# EAGLE design ESP32 Module (EAGLE 9.6.2)
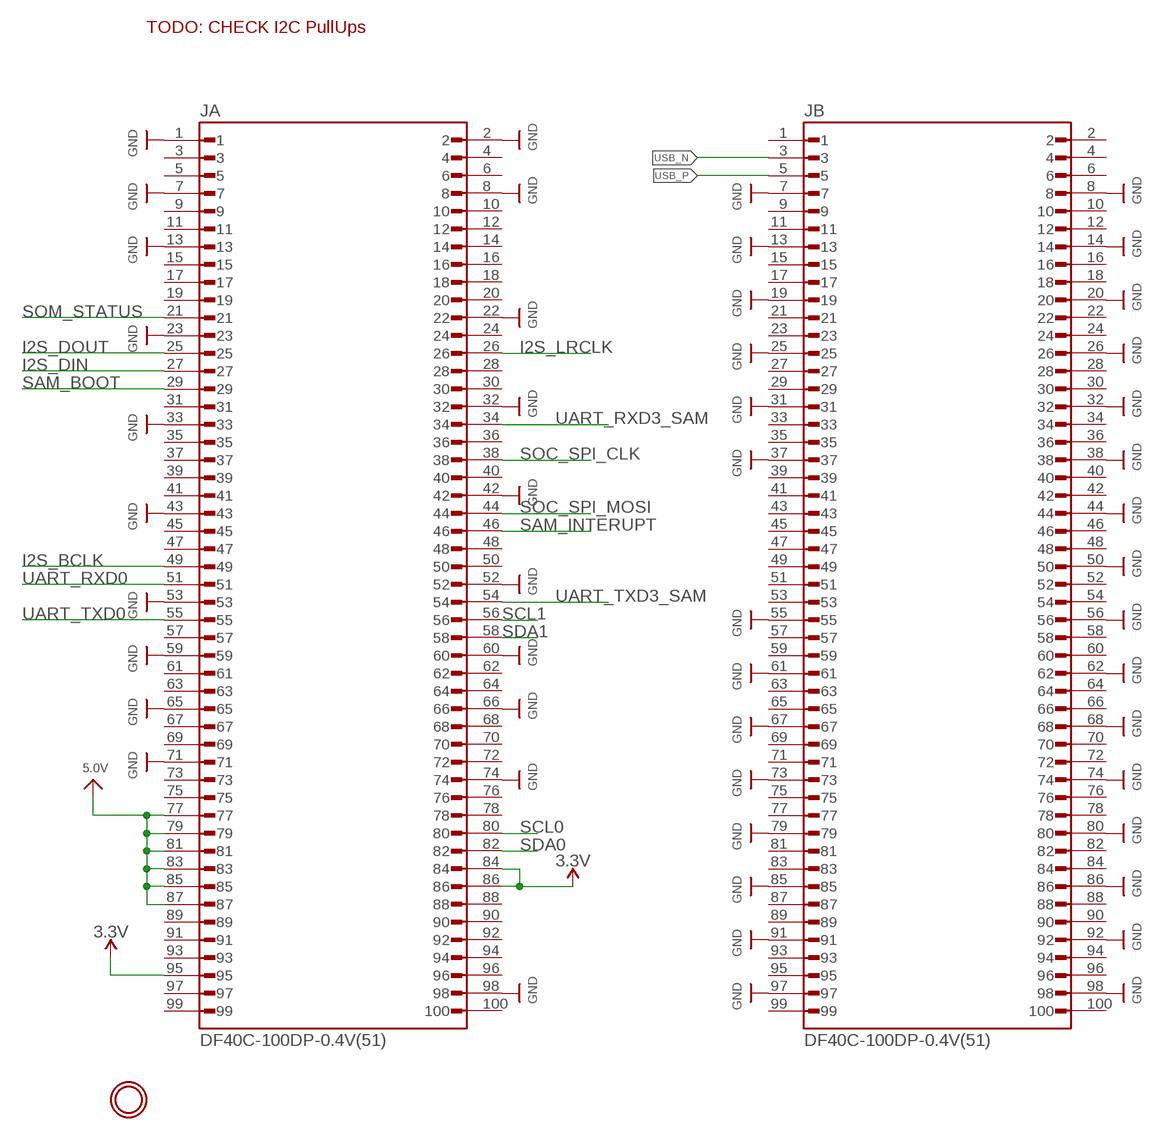
[diagram p0: schematic, sheet 1, part 1 of 3]
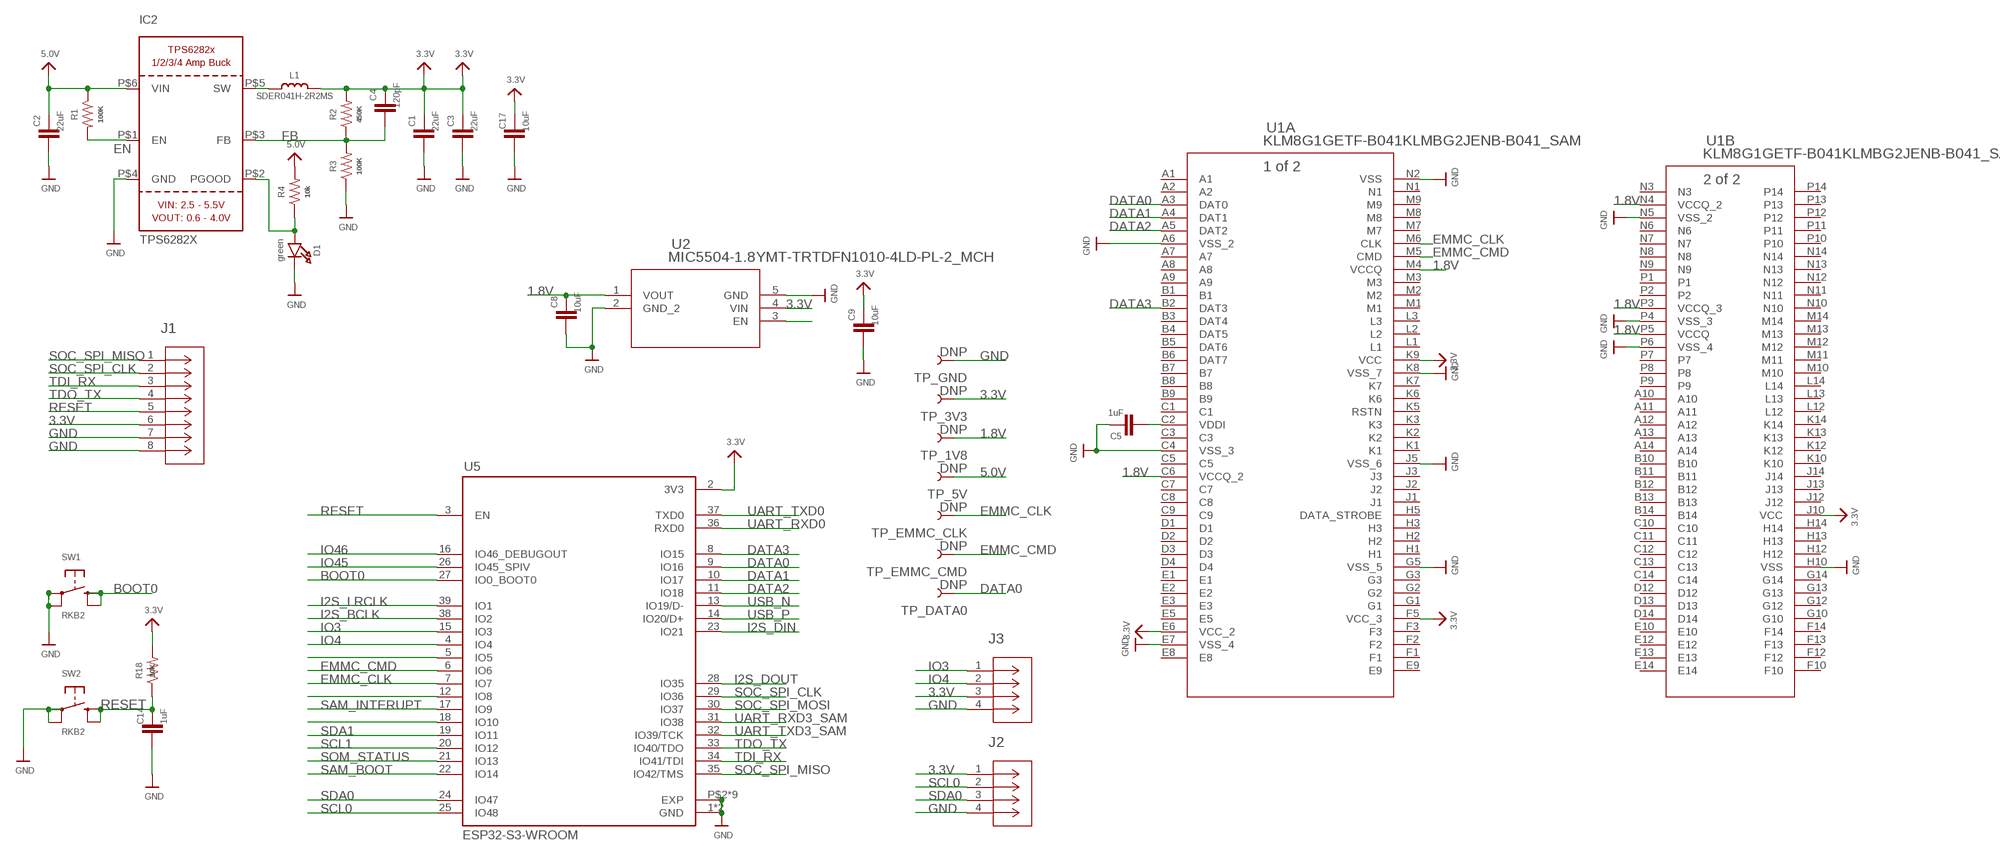
[diagram p1: schematic, sheet 1, part 2 of 3]
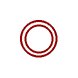
[diagram p2: schematic, sheet 1, part 3 of 3]

## Parts
C1  22uF  C_CHIP-0402(1005-METRIC)  [CAPC1005X60]
C2  22uF  C_CHIP-0603(1608-METRIC)  [CAPC1608X85]
C3  22uF  C_CHIP-0402(1005-METRIC)  [CAPC1005X60]
C4  120pF  C_CHIP-0402(1005-METRIC)  [CAPC1005X60]
C5  1uF  C_CHIP-0402(1005-METRIC)  [CAPC1005X60]
C8  10uF  C_CHIP-0402(1005-METRIC)  [CAPC1005X60]
C9  10uF  C_CHIP-0402(1005-METRIC)  [CAPC1005X60]
C14  1uF  C_CHIP-0402(1005-METRIC)  [CAPC1005X60]
C17  10uF  C_CHIP-0402(1005-METRIC)  [CAPC1005X60]
D1  green  LED0603_NOOUTLINE  [CHIPLED_0603_NOOUTLINE]
IC2  TPS6282X  [VSON_6]
J1  SM08B-SRSS-TB(LF)(SN)CONN_SM08B-SRSS-TB(LF)(SN)_JST  [CONN_SM08B-SRSS-TB(LF)(SN)_JST]
J2  SM04B-SRSS-TBCONN_SM04B-SRSS-TB_JST  [CONN_SM04B-SRSS-TB_JST]
J3  SM04B-SRSS-TBCONN_SM04B-SRSS-TB_JST  [CONN_SM04B-SRSS-TB_JST]
JA  DF40C-100DP-0.4V(51)  [HIROSE_DF40C-100DP-0.4V(51)]
JB  DF40C-100DP-0.4V(51)  [HIROSE_DF40C-100DP-0.4V(51)]
L1  SDER041H-2R2MS  INDUCTOR_SRP0415  [INDUCTOR_4X4MM_SRP0415]
R1  100K  R-US_CHIP-0402(1005-METRIC)  [RESC1005X40]
R2  450K  R-US_CHIP-0402(1005-METRIC)  [RESC1005X40]
R3  100K  R-US_CHIP-0402(1005-METRIC)  [RESC1005X40]
R4  10k  R-US_CHIP-0402(1005-METRIC)  [RESC1005X40]
R18  10K  R-US_CHIP-0402(1005-METRIC)  [RESC1005X40]
SW1  RKB2  SWITCH_TACT_SMT_RKB2  [BTN_RKB2_4.6X2.8]
SW2  RKB2  SWITCH_TACT_SMT_RKB2  [BTN_RKB2_4.6X2.8]
TP_1V8  DNP  TEST-POINT3  [PAD.03X.03]
TP_3V3  DNP  TEST-POINT3  [PAD.03X.03]
TP_5V  DNP  TEST-POINT3  [PAD.03X.03]
TP_DATA0  DNP  TEST-POINT3  [PAD.03X.03]
TP_EMMC_CLK  DNP  TEST-POINT3  [PAD.03X.03]
TP_EMMC_CMD  DNP  TEST-POINT3  [PAD.03X.03]
TP_GND  DNP  TEST-POINT3  [PAD.03X.03]
U1  KLM8G1GETF-B041KLMBG2JENB-B041_SAM  [KLMBG2JENB-B041_SAM]
U2  MIC5504-1.8YMT-TRTDFN1010-4LD-PL-2_MCH  [TDFN1010-4LD-PL-2_MCH]
U5  ESP32-S3-WROOM  [S3-WROOM32]
U$2  MOUNTINGHOLE2.5  [MOUNTINGHOLE_2.5_PLATED]
U$120  MOUNTINGHOLE2.5  [MOUNTINGHOLE_2.5_PLATED]

## Nets
1.8V: C8.1 TP_1V8.P$1 U1.C6(A:VCCQ_2) U1.M4(A:VCCQ) U1.N4(B:VCCQ_2) U1.P3(B:VCCQ_3) U1.P5(B:VCCQ) U2.1(VOUT)
3.3V: C1.1 C3.1 C4.1 C9.1 C17.1 J1.6 J2.1 J3.3 JA.84 JA.86 JA.95 L1.P$2 R2.2 R18.2 TP_3V3.P$1 U1.E6(A:VCC_2) U1.F5(A:VCC_3) U1.J10(B:VCC) U1.K9(A:VCC) U2.4(VIN) U5.2(3V3)
5.0V: C2.1 IC2.P$6(VIN) JA.77 JA.79 JA.81 JA.83 JA.85 JA.87 R1.1 R4.2 TP_5V.P$1
BOOT0: SW1.B'(S1) SW1.B(S) U5.27(IO0_BOOT0)
DATA0: TP_DATA0.P$1 U1.A3(A:DAT0) U5.9(IO16)
DATA1: U1.A4(A:DAT1) U5.10(IO17)
DATA2: U1.A5(A:DAT2) U5.11(IO18)
DATA3: U1.B2(A:DAT3) U5.8(IO15)
EMMC_CLK: TP_EMMC_CLK.P$1 U1.M6(A:CLK) U5.7(IO7)
EMMC_CMD: TP_EMMC_CMD.P$1 U1.M5(A:CMD) U5.6(IO6)
EN: IC2.P$1(EN) R1.2
FB: C4.2 IC2.P$3(FB) R2.1 R3.2
GND: C1.2 C2.2 C3.2 C5.1 C8.2 C9.2 C14.2 C17.2 D1.C IC2.P$4(GND) J1.7 J1.8 J2.4 J3.4 JA.1 JA.2 JA.7 JA.8 JA.13 JA.22 JA.23 JA.32 JA.33 JA.42 JA.43 JA.52 JA.53 JA.59 JA.60 JA.65 JA.66 JA.71 JA.74 JA.98 JB.7 JB.8 JB.13 JB.14 JB.19 JB.20 JB.25 JB.26 JB.31 JB.32 JB.37 JB.38 JB.44 JB.50 JB.55 JB.56 JB.61 JB.62 JB.67 JB.68 JB.73 JB.74 JB.79 JB.80 JB.85 JB.86 JB.91 JB.92 JB.97 JB.98 R3.1 SW1.A'(P1) SW1.A(P) SW2.A'(P1) SW2.A(P) TP_GND.P$1 U1.A6(A:VSS_2) U1.C4(A:VSS_3) U1.E7(A:VSS_4) U1.G5(A:VSS_5) U1.H10(B:VSS) U1.J5(A:VSS_6) U1.K8(A:VSS_7) U1.N2(A:VSS) U1.N5(B:VSS_2) U1.P4(B:VSS_3) U1.P6(B:VSS_4) U2.2(GND_2) U2.5(GND) U5.1(GND) U5.40(GND) U5.P$2(EXP) U5.P$3(EXP) U5.P$4(EXP) U5.P$5(EXP) U5.P$6(EXP) U5.P$7(EXP) U5.P$8(EXP) U5.P$9(EXP) U5.P$10(EXP)
I2S_BCLK: JA.49 U5.38(IO2)
I2S_DIN: JA.27 U5.23(IO21)
I2S_DOUT: JA.25 U5.28(IO35)
I2S_LRCLK: JA.26 U5.39(IO1)
IO3: J3.1 U5.15(IO3)
IO4: J3.2 U5.4(IO4)
IO10: U5.18(IO10)
IO45: U5.26(IO45_SPIV)
IO46: U5.16(IO46_DEBUGOUT)
N$1: IC2.P$5(SW) L1.P$1
N$2: D1.A IC2.P$2(PGOOD) R4.1
N$3: U5.5(IO5)
N$4: U5.12(IO8)
N$8: C5.2 U1.C2(A:VDDI)
N$9: U2.3(EN)
RESET: C14.1 J1.5 R18.1 SW2.B'(S1) SW2.B(S) U5.3(EN)
SAM_BOOT: JA.29 U5.22(IO14)
SAM_INTERUPT: JA.46 U5.17(IO9)
SCL0: J2.2 JA.80 U5.25(IO48)
SCL1: JA.56 U5.20(IO12)
SDA0: J2.3 JA.82 U5.24(IO47)
SDA1: JA.58 U5.19(IO11)
SOC_SPI_CLK: J1.2 JA.38 U5.29(IO36)
SOC_SPI_MISO: J1.1 U5.35(IO42/TMS)
SOC_SPI_MOSI: JA.44 U5.30(IO37)
SOM_STATUS: JA.21 U5.21(IO13)
TDI_RX: J1.3 U5.34(IO41/TDI)
TDO_TX: J1.4 U5.33(IO40/TDO)
UART_RXD0: JA.51 U5.36(RXD0)
UART_RXD3_SAM: JA.34 U5.31(IO38)
UART_TXD0: JA.55 U5.37(TXD0)
UART_TXD3_SAM: JA.54 U5.32(IO39/TCK)
USB_N: JB.3 U5.13(IO19/D-)
USB_P: JB.5 U5.14(IO20/D+)
Unconnected: JA.3 JA.4 JA.5 JA.6 JA.9 JA.10 JA.11 JA.12 JA.14 JA.15 JA.16 JA.17 JA.18 JA.19 JA.20 JA.24 JA.28 JA.30 JA.31 JA.35 JA.36 JA.37 JA.39 JA.40 JA.41 JA.45 JA.47 JA.48 JA.50 JA.57 JA.61 JA.62 JA.63 JA.64 JA.67 JA.68 JA.69 JA.70 JA.72 JA.73 JA.75 JA.76 JA.78 JA.88 JA.89 JA.90 JA.91 JA.92 JA.93 JA.94 JA.96 JA.97 JA.99 JA.100 JB.1 JB.2 JB.4 JB.6 JB.9 JB.10 JB.11 JB.12 JB.15 JB.16 JB.17 JB.18 JB.21 JB.22 JB.23 JB.24 JB.27 JB.28 JB.29 JB.30 JB.33 JB.34 JB.35 JB.36 JB.39 JB.40 JB.41 JB.42 JB.43 JB.45 JB.46 JB.47 JB.48 JB.49 JB.51 JB.52 JB.53 JB.54 JB.57 JB.58 JB.59 JB.60 JB.63 JB.64 JB.65 JB.66 JB.69 JB.70 JB.71 JB.72 JB.75 JB.76 JB.77 JB.78 JB.81 JB.82 JB.83 JB.84 JB.87 JB.88 JB.89 JB.90 JB.93 JB.94 JB.95 JB.96 JB.99 JB.100 U1.A1(A:A1) U1.A2(A:A2) U1.A7(A:A7) U1.A8(A:A8) U1.A9(A:A9) U1.A10(B:A10) U1.A11(B:A11) U1.A12(B:A12) U1.A13(B:A13) U1.A14(B:A14) U1.B1(A:B1) U1.B3(A:DAT4) U1.B4(A:DAT5) U1.B5(A:DAT6) U1.B6(A:DAT7) U1.B7(A:B7) U1.B8(A:B8) U1.B9(A:B9) U1.B10(B:B10) U1.B11(B:B11) U1.B12(B:B12) U1.B13(B:B13) U1.B14(B:B14) U1.C1(A:C1) U1.C3(A:C3) U1.C5(A:C5) U1.C7(A:C7) U1.C8(A:C8) U1.C9(A:C9) U1.C10(B:C10) U1.C11(B:C11) U1.C12(B:C12) U1.C13(B:C13) U1.C14(B:C14) U1.D1(A:D1) U1.D2(A:D2) U1.D3(A:D3) U1.D4(A:D4) U1.D12(B:D12) U1.D13(B:D13) U1.D14(B:D14) U1.E1(A:E1) U1.E2(A:E2) U1.E3(A:E3) U1.E5(A:E5) U1.E8(A:E8) U1.E9(A:E9) U1.E10(B:E10) U1.E12(B:E12) U1.E13(B:E13) U1.E14(B:E14) U1.F1(A:F1) U1.F2(A:F2) U1.F3(A:F3) U1.F10(B:F10) U1.F12(B:F12) U1.F13(B:F13) U1.F14(B:F14) U1.G1(A:G1) U1.G2(A:G2) U1.G3(A:G3) U1.G10(B:G10) U1.G12(B:G12) U1.G13(B:G13) U1.G14(B:G14) U1.H1(A:H1) U1.H2(A:H2) U1.H3(A:H3) U1.H5(A:DATA_STROBE) U1.H12(B:H12) U1.H13(B:H13) U1.H14(B:H14) U1.J1(A:J1) U1.J2(A:J2) U1.J3(A:J3) U1.J12(B:J12) U1.J13(B:J13) U1.J14(B:J14) U1.K1(A:K1) U1.K2(A:K2) U1.K3(A:K3) U1.K5(A:RSTN) U1.K6(A:K6) U1.K7(A:K7) U1.K10(B:K10) U1.K12(B:K12) U1.K13(B:K13) U1.K14(B:K14) U1.L1(A:L1) U1.L2(A:L2) U1.L3(A:L3) U1.L12(B:L12) U1.L13(B:L13) U1.L14(B:L14) U1.M1(A:M1) U1.M2(A:M2) U1.M3(A:M3) U1.M7(A:M7) U1.M8(A:M8) U1.M9(A:M9) U1.M10(B:M10) U1.M11(B:M11) U1.M12(B:M12) U1.M13(B:M13) U1.M14(B:M14) U1.N1(A:N1) U1.N3(B:N3) U1.N6(B:N6) U1.N7(B:N7) U1.N8(B:N8) U1.N9(B:N9) U1.N10(B:N10) U1.N11(B:N11) U1.N12(B:N12) U1.N13(B:N13) U1.N14(B:N14) U1.P1(B:P1) U1.P2(B:P2) U1.P7(B:P7) U1.P8(B:P8) U1.P9(B:P9) U1.P10(B:P10) U1.P11(B:P11) U1.P12(B:P12) U1.P13(B:P13) U1.P14(B:P14)

## Notes on the sheet
- TODO: CHECK I2C PullUps

## Library data of the parts
C1-C5 C8 C9 C14 C17 = Capacitor:C: Capacitor - Generic; CATEGORY: Capacitor
D1 = microbuilder:LED: LED 0603 - 0603 Surface Mount Package 2mA: Green LED - Low Power (3.9mcd, 2ma, 1.7Vf) - Digikey: 475-2709-2-ND Orange LED - Low Power (9.8mcd, 2ma, 1.8Vf) - Digikey: 475-1194-2-ND Red LED - Low Power (5mcd, 2ma, 1.8Vf) - Digikey: 475-1195-2-ND Yellow LED - Low Power (7mcd, 2ma, 1.8Vf) - Digikey: 475-1196-2-ND 5mA: Blue LED - Low Power (17mcd, 5ma, 2.9Vf) - Digikey: LNJ937W8CRACT-ND 0805 - 0805 Surface Mount Package 2mA: Red LED (8.8mcd, 2mA, 1.8Vf, Clear) - Low Power [Digikey: 475-2510-1-ND] Green LED (5mcd, 2mA, 1.8Vf, Clear) - Low Power [Digikey: 475-2730-1-ND] Yellow LED (11.3mcd, 2mA, 1.8Vf, Clear) - Low Power [Digikey: 475-2555-1-ND] 20mA: Red LED (104mcd, 20mA, Diffused) - LS R976 [Digikey: 475-1278-6-ND] Red LED (12mcd, 20mA, 2.0Vf, Clear) - APT2012EC [Digikey: 754-1128-1-ND] Green LED (15mcd, 20mA, 2.2Vf, Clear) - APT2012GC [Digikey: 754-1131-1-ND] Orange LED (160mcd, 20mA, 2.1Vf, Clear) - APT2012SECK [Digikey: 754-1130-1-ND] 1206 - 1206 Surface Mount Package Green LED (26mcd, 20mA, Diffused) - LG N971 [Digikey: 475-1407-6-ND] Red LED (15mcd, 20mA, Diffused) - LH N974 [Digikey: 475-1416-6-ND] Cree - Cree High-Power Surface Mount LEDs XPEBWT-L1-0000-00D50 - White 111lm 350mA 2.9Vf 6200K 110° XTEAWT-00-0000-00000LEE3 - White 114lm 350mA 2.85Vf 5000K 115° Everlight - Everlight 45-21 Series Surface Mount LEDs 45-21/QK2C-B2832AC2CB2/2T - Warm White 2000mcd 20mA 3.25Vf 3050K 120° 45-21/LK2C-B38452C4CB2/2T - Nuetral White 2000mcd 20mA 3.25Vf 4150K 120° 45-21/LK2C-B50634C6CB2/2T - Cold White 2200mcd 20mA 3.25Vf 5650K 120° PLCC2 Reverse Mount LS T77K-J1L2-1-0-2-R18-Z - Red 11.25mcd 2mA 1.8Vf 630nm 120° LO T77K-L1M2-24-Z - Orange 19.6mcd 2mA 1.8Vf 606nm 120° LY T77K-K2M1-26-Z - Yellow 15.7mcd 2mA 1.8Vf 587nm 120°; ROT: 270
IC2 = adafruit_power:TPS6282X
J1 = 2024-07-31_09-31-28_Library:SM08B-SRSS-TB(LF)(SN); COPYRIGHT: Copyright (C) 2024 Ultra Librarian. All rights reserved.; MANUFACTURER_PART_NUMBER: SM08B-SRSS-TB(LF)(SN); MFR_NAME: JST
J2 J3 = 2024-07-31_09-55-08_Library:SM04B-SRSS-TB; COPYRIGHT: Copyright (C) 2024 Ultra Librarian. All rights reserved.; MANUFACTURER_PART_NUMBER: SM04B-SRSS-TB; MFR_NAME: JST
JA JB = DF40C-100DP-0.4V_51_:DF40C-100DP-0.4V(51); MANUFACTURER: Hirose; MAXIMUM_PACKAGE_HEIGHT: 1.29mm; PARTREV: 8; STANDARD: Manufacturer Recommendations
L1 = microbuilder:INDUCTOR: Inductors 0603: 10nH Ceramic Inductor - microwire antenna/RF (Digikey: 712-1434-2-ND) 0805: 560nH Ceramic Inductor - RF (Digikey: 553-1047-1-ND) 270nH Ceramic Inductor - Q = 40@250MHz, +-5%, 1 Ohm DC Resistance (Digikey: 535-10506-2-ND) 1007 (2518 Metric) SMT: 10µH 10% 250mOhm 820mA 1007 Inductor (Digikey: 587-2189-1-ND) 22µH 10% 500mOhm 580mA 1007 Inductor (Digikey: 587-2190-1-ND) 47µH 10% 950mOhm 420mA 1007 Inductor (Digikey: 587-2191-1-ND) 47µH 5% 100mOhm 1A 1008 Inductor (Digikey: 732-1816-1-ND) 5.0x5.0mm (Taiyo Yuden NR5040 Series) 6.8µH 20% 2.3A 64mOhm Inductor (Digikey: 587-2374-2-ND) 5.0x5.0mm (TDK VLC5045 Series) 4.7µH 20% 3.3A 34mOhm Inductor (Digikey: 445-6526-1-ND) 6.8µH 20% 2.7A 46mOhm Inductor (Digikey: 445-6527-1-ND) 6.0x6.0mm (TDK VLC6045 Series) 4.7µH 20% 3.8A 27mOhm Inductor (Digikey: 445-6538-2-ND) 6.8µH 20% 3A 41mOhm Inductor (Digikey: 445-6540-1-ND) 6.2µH 30% 2.2A 45mOhm Inductor (Digikey: SRR5028-6R2YCT-ND) - Not TDK VLC6045 but footprint should match 6.0x6.0mm (TDK SLF6045 Series) 6.8uH 30% 2A 33mOhm Inductor (Digikey: 445-4572-1-ND, Mouser: 810-SLF645T6R8N2R0PF) 6.0x6.0mm (Sumida CDRH5D28 Series) 6.2uH 30% 1.8A 45mOhm Inductor (Digikey: 308-1542-1-ND) Taiyo Yuden NR3015T2R2M - 2.2uH 20% 1.5A (Digikey: 587-1648-2-ND, Mouser: 963-NR3015T2R2M) - Used with TI TPS62172 CoilCraft RFID Transponder Coil - MA5532-AE (For use with AS3935 Lightning Sensor) Taiyo Yuden NRH2412T2R2MNGH - 2.2uH 20% 1AA (Digikey: 587-3443-1-ND) - Used with TI LM3671 Vishay IHLP 1.0uH Molded Inductor - 24mOhm DCR, 5A, +/-20%, -55°C-125°C (Digikey: 541-1319-1-ND)
R1-R4 R18 = Resistor:R-US: Resistor Fixed - ANSI; CATEGORY: Resistor; SUB-CATEGORY: Fixed
SW1 SW2 = adafruit_electromech:SWITCH_TACT_SMT: SMT Tact Switches RKB2 https://www.digikey.com/short/m027prz5
TP_1V8 TP_3V3 TP_5V TP_DATA0 TP_EMMC_CLK TP_EMMC_CMD TP_GND = SparkFun-Connectors:TEST-POINT: SparkFun Test Points Bare copper test points for troubleshooting or In-Circuit-Testing. These are used by our Production team for verifying production board runs using pogo-pins on test beds. SparkFun Products: SparkFun LSM9DS1 Breakout <https://www.sparkfun.com/products/13284> SparkFun PSOC <https://www.sparkfun.com/products/13714> SparkFun Load Cell Amplifier <https://www.sparkfun.com/products/13879>
U1 = 2024-07-31_09-44-36_Library:KLM8G1GETF-B041; COPYRIGHT: Copyright (C) 2024 Ultra Librarian. All rights reserved.; MANUFACTURER_PART_NUMBER: KLM8G1GETF-B041; MFR_NAME: Samsung
U2 = 2024-08-01_07-42-38_Library:MIC5504-1.8YMT-TR; COPYRIGHT: Copyright (C) 2024 Ultra Librarian. All rights reserved.; MANUFACTURER_PART_NUMBER: MIC5504-1.8YMT-TR; MFR_NAME: Microchip
U5 = adafruit_wireless:ESP32-S3-WROOM: WiFi 802.11b/g/n Transceiver Module 2.4GHz Antenna Not Included Surface Mount Check prices <https://snapeda.com/parts/ESP32-S2-WROVER/Espressif%20Systems/view-part/?ref=eda>
U$2 U$120 = microbuilder:MOUNTINGHOLE: Mounting Hole For #2 screws (0.086"/2.18mm width, 0.094"/2.4mm hole) use 2.5mm; BOM: EXCLUDE

## Net classes
2 lowpower: width 0.305 mm, drill 0.483 mm
3 Power: width 0.305 mm, drill 0.483 mm

## Board
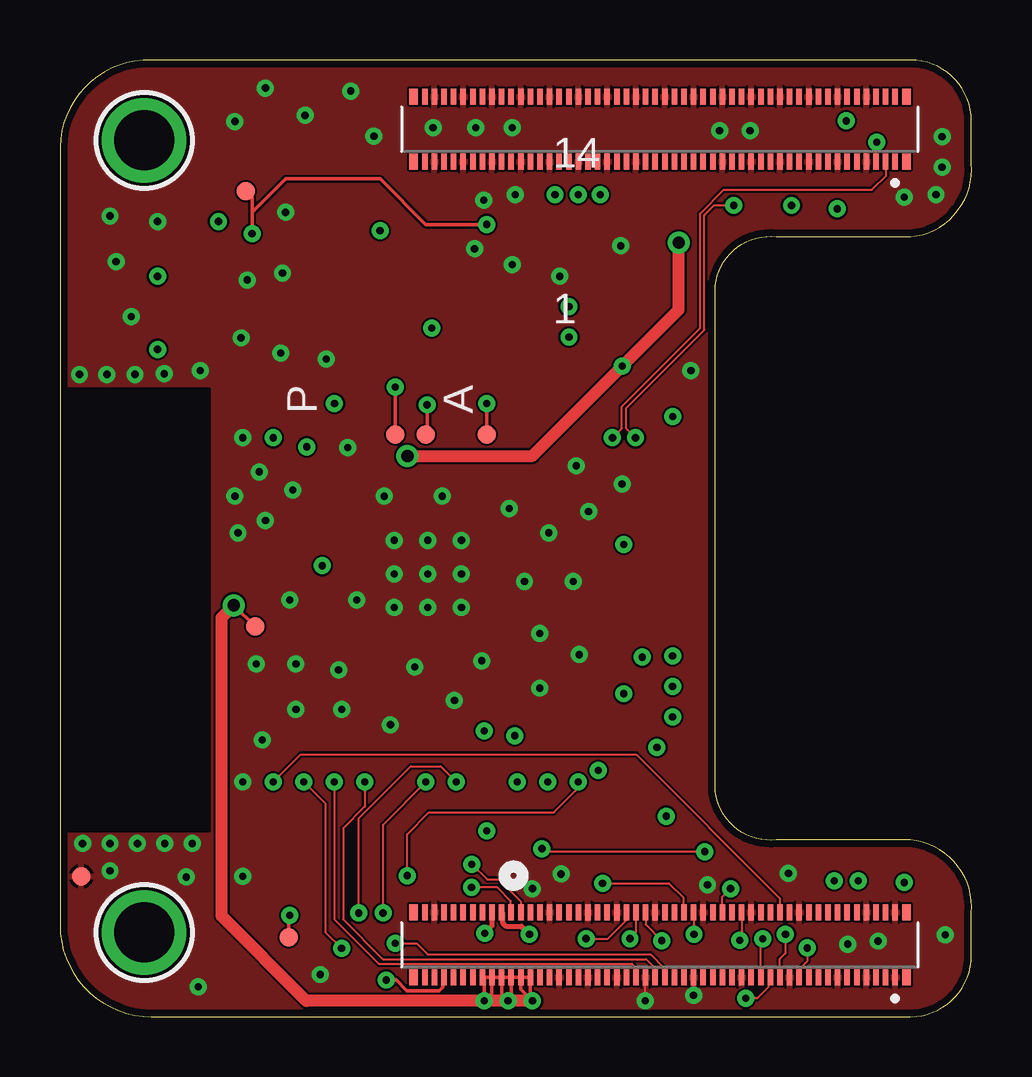
[diagram p3: board, top side]
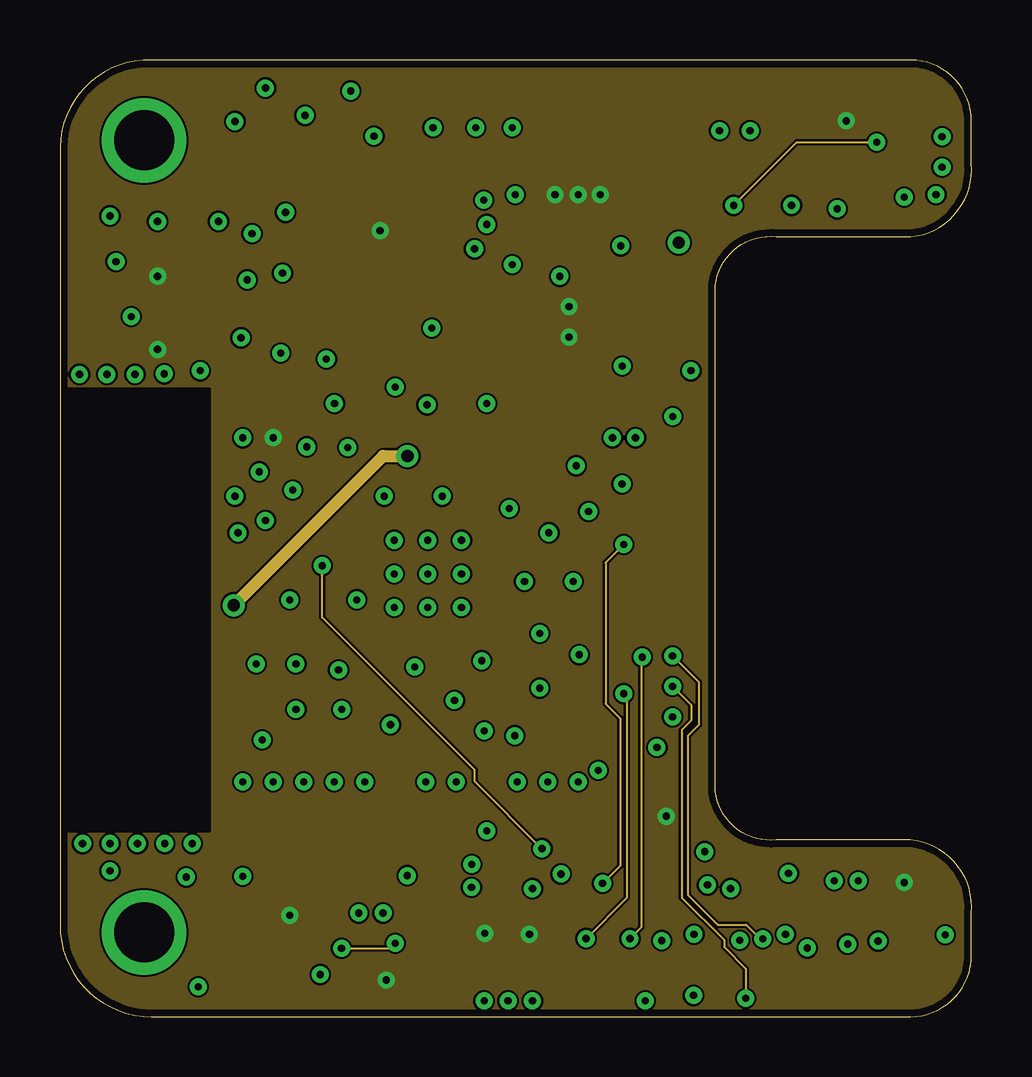
[diagram p4: board, inner layer Route2]
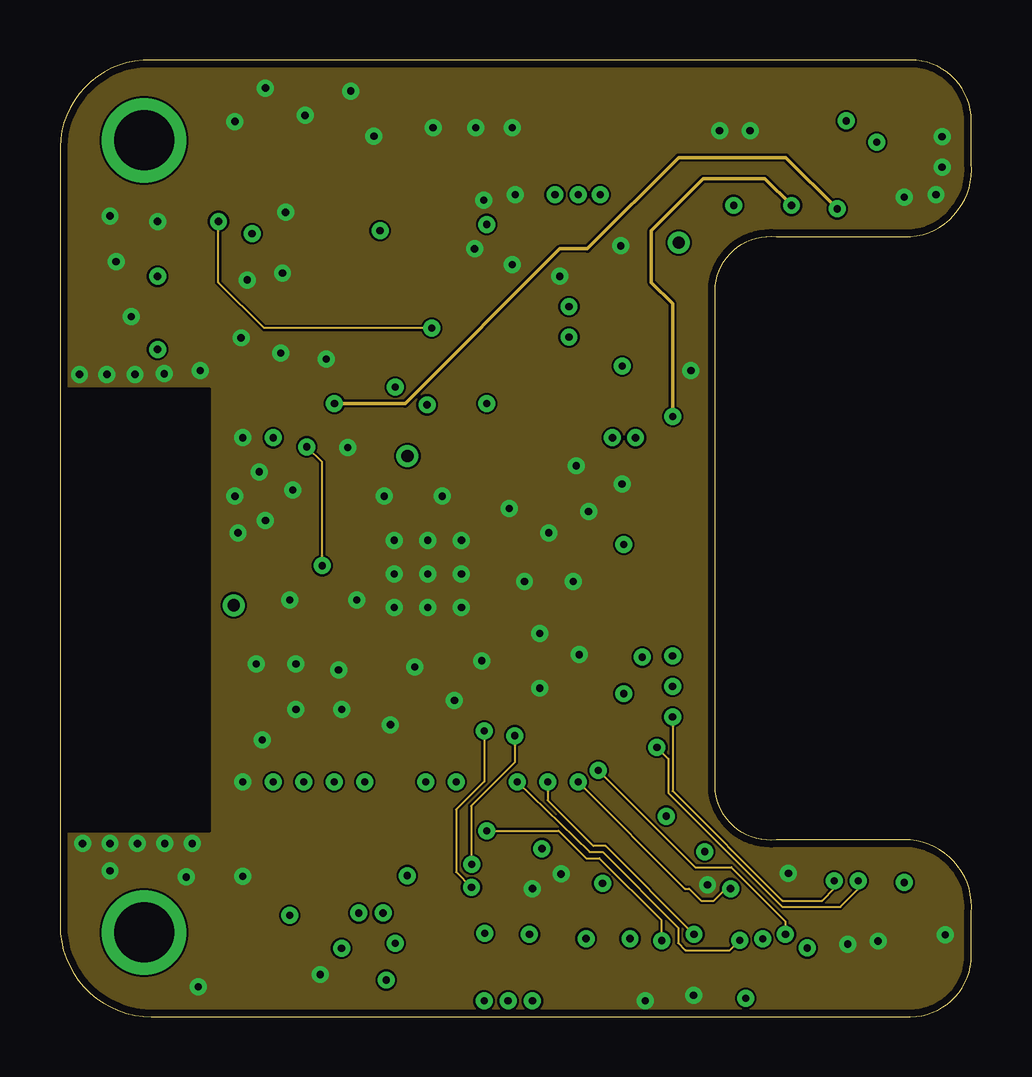
[diagram p5: board, inner layer Route15]
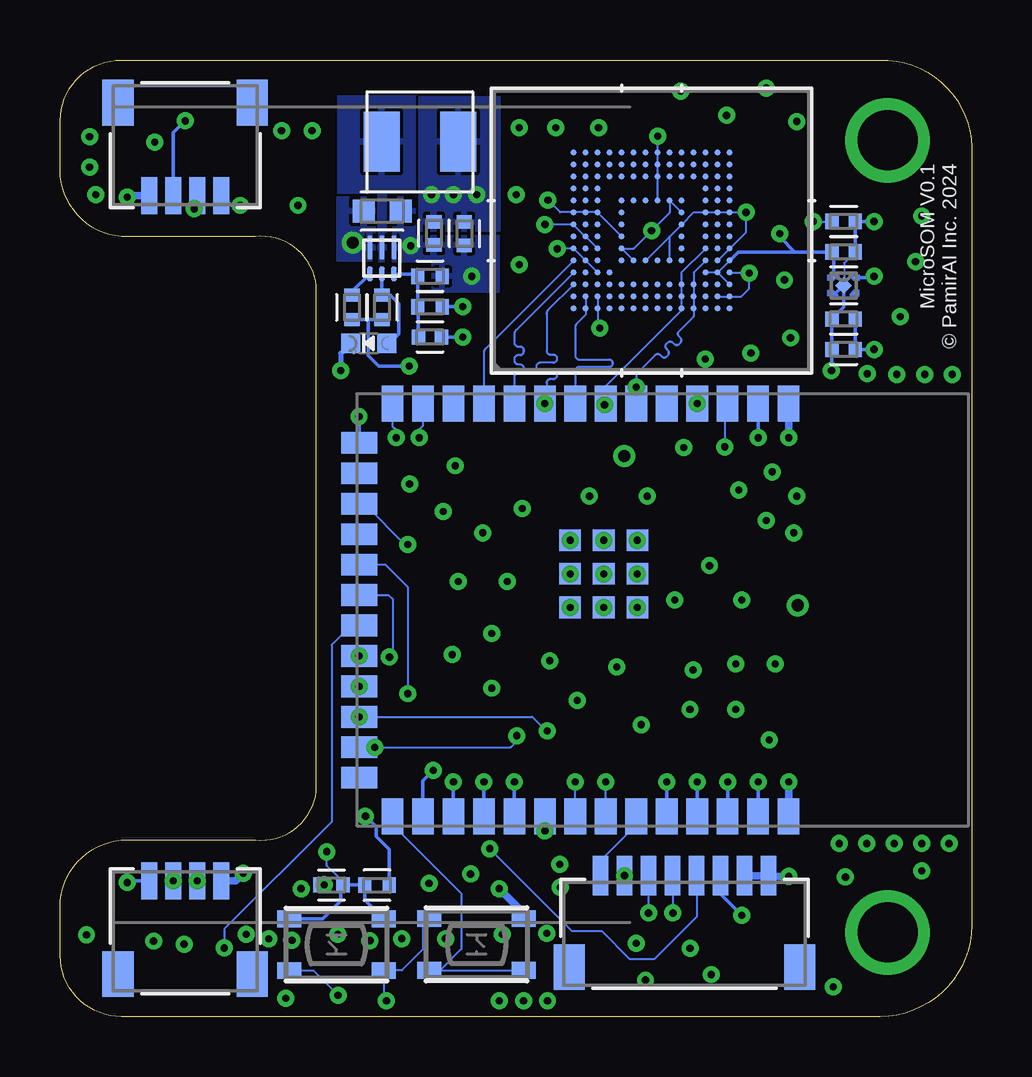
[diagram p6: board, bottom side, seen from below]

Size 37.98 x 39.88 mm. Coordinates in mm from the lower left corner, seen from the top.
Outline: 0,36.25 0,3.81 arc90 3.81,0 35.43,0 arc90 37.97,2.54 37.97,4.32 arc90 35.43,7.37 29.84,7.37 arc-90 27.3,9.4 27.3,30.48 arc-90 29.84,32.51 35.43,32.51 arc90 37.97,35.56 37.97,37.34 arc90 35.43,39.88 3.81,39.88 arc90 0,36.25
Copper layers (1+2*15+16): Top 0.035mm / dielectric 0.2104mm / Route2 0.0152mm / dielectric 1.065mm / Route15 0.0152mm / dielectric 0.2104mm / Bottom 0.035mm
Design rules "default *": minimum track width 3.5mil, minimum drill 0.3mm, track to track 3.5mil, track to pad 6mil, pad to pad 6mil, via to via 10mil, smd to smd 6mil, copper to edge 0.3mm, drill to drill 6mil, minimum pad ring 10mil, minimum via ring 8mil, stop-mask expansion 4mil, vias tented up to drill 20mil, thermal gap 6mil

### Footprints (pad centres in the part's own frame; a part is rotated, then mirrored left to right if it is on the bottom)
CAPC1005X60 = smd 0.56 x 0.629: 1 -0.485,0; 2 0.485,0
CAPC1608X85 = smd 0.921 x 0.97: 1 -0.775,0; 2 0.775,0
CHIPLED_0603_NOOUTLINE = smd 0.8 x 0.8: A 0,-0.75; C 0,0.75
VSON_6 = smd 0.6 x 0.25: P$1 -0.65,0.5; P$2 -0.65,0; P$3 -0.65,-0.5 | smd 1 x 0.2: P$4 0.45,-0.5; P$5 0.45,0; P$6 0.45,0.5
CONN_SM08B-SRSS-TB(LF)(SN)_JST = smd 0.66 x 1.651: 1 -3.5,2.421; 2 -2.5,2.421; 3 -1.5,2.421; 4 -0.5,2.421; 5 0.5,2.421; 6 1.5,2.421; 7 2.5,2.421; 8 3.5,2.421 | smd 1.295 x 1.905: 9 -4.8,-1.394; 10 4.8,-1.394
CONN_SM04B-SRSS-TB_JST = smd 0.66 x 1.549: 1 1.5,-2.099; 2 0.5,-2.099; 3 -0.5,-2.099; 4 -1.5,-2.099 | smd 1.295 x 1.905: 5 -2.8,1.776; 6 2.8,1.776
HIROSE_DF40C-100DP-0.4V(51) = smd 0.23 x 0.66: 1 -9.8,1.355; 2 -9.8,-1.355; 3 -9.4,1.355; 4 -9.4,-1.355; 5 -9,1.355; 6 -9,-1.355; 7 -8.6,1.355; 8 -8.6,-1.355; 9 -8.2,1.355; 10 -8.2,-1.355; 11 -7.8,1.355; 12 -7.8,-1.355; 13 -7.4,1.355; 14 -7.4,-1.355; 15 -7,1.355; 16 -7,-1.355; 17 -6.6,1.355; 18 -6.6,-1.355; 19 -6.2,1.355; 20 -6.2,-1.355; 21 -5.8,1.355; 22 -5.8,-1.355; 23 -5.4,1.355; 24 -5.4,-1.355; 25 -5,1.355; 26 -5,-1.355; 27 -4.6,1.355; 28 -4.6,-1.355; 29 -4.2,1.355; 30 -4.2,-1.355; 31 -3.8,1.355; 32 -3.8,-1.355; 33 -3.4,1.355; 34 -3.4,-1.355; 35 -3,1.355; 36 -3,-1.355; 37 -2.6,1.355; 38 -2.6,-1.355; 39 -2.2,1.355; 40 -2.2,-1.355; 41 -1.8,1.355; 42 -1.8,-1.355; 43 -1.4,1.355; 44 -1.4,-1.355; 45 -1,1.355; 46 -1,-1.355; 47 -0.6,1.355; 48 -0.6,-1.355; 49 -0.2,1.355; 50 -0.2,-1.355; 51 0.2,1.355; 52 0.2,-1.355; 53 0.6,1.355; 54 0.6,-1.355; 55 1,1.355; 56 1,-1.355; 57 1.4,1.355; 58 1.4,-1.355; 59 1.8,1.355; 60 1.8,-1.355; 61 2.2,1.355; 62 2.2,-1.355; 63 2.6,1.355; 64 2.6,-1.355; 65 3,1.355; 66 3,-1.355; 67 3.4,1.355; 68 3.4,-1.355; 69 3.8,1.355; 70 3.8,-1.355; 71 4.2,1.355; 72 4.2,-1.355; 73 4.6,1.355; 74 4.6,-1.355; 75 5,1.355; 76 5,-1.355; 77 5.4,1.355; 78 5.4,-1.355; 79 5.8,1.355; 80 5.8,-1.355; 81 6.2,1.355; 82 6.2,-1.355; 83 6.6,1.355; 84 6.6,-1.355; 85 7,1.355; 86 7,-1.355; 87 7.4,1.355; 88 7.4,-1.355; 89 7.8,1.355; 90 7.8,-1.355; 91 8.2,1.355; 92 8.2,-1.355; 93 8.6,1.355; 94 8.6,-1.355; 95 9,1.355; 96 9,-1.355; 97 9.4,1.355; 98 9.4,-1.355; 99 9.8,1.355; 100 9.8,-1.355 | smd 0.35 x 0.66: S1 -10.275,1.355; S2 -10.275,-1.355; S3 10.275,1.355; S4 10.275,-1.355
INDUCTOR_4X4MM_SRP0415 = smd 1.5 x 2.5: P$1 -1.6,0; P$2 1.6,0
RESC1005X40 = smd 0.535 x 0.644: 1 -0.507,0; 2 0.507,0
BTN_RKB2_4.6X2.8 = smd 1 x 0.7: A 1.973,1.075; A' -1.973,1.075; B 1.973,-1.075; B' -1.973,-1.075
PAD.03X.03 = smd 0.762 x 0.762: P$1 0,0
KLMBG2JENB-B041_SAM = smd 0.254 x 0.254: A1 -3.25,3.25; A2 -2.75,3.25; A3 -2.25,3.25; A4 -1.75,3.25; A5 -1.25,3.25; A6 -0.75,3.25; A7 -0.25,3.25; A8 0.25,3.25; A9 0.75,3.25; A10 1.25,3.25; A11 1.75,3.25; A12 2.25,3.25; A13 2.75,3.25; A14 3.25,3.25; B1 -3.25,2.75; B2 -2.75,2.75; B3 -2.25,2.75; B4 -1.75,2.75; B5 -1.25,2.75; B6 -0.75,2.75; B7 -0.25,2.75; B8 0.25,2.75; B9 0.75,2.75; B10 1.25,2.75; B11 1.75,2.75; B12 2.25,2.75; B13 2.75,2.75; B14 3.25,2.75; C1 -3.25,2.25; C2 -2.75,2.25; C3 -2.25,2.25; C4 -1.75,2.25; C5 -1.25,2.25; C6 -0.75,2.25; C7 -0.25,2.25; C8 0.25,2.25; C9 0.75,2.25; C10 1.25,2.25; C11 1.75,2.25; C12 2.25,2.25; C13 2.75,2.25; C14 3.25,2.25; D1 -3.25,1.75; D2 -2.75,1.75; D3 -2.25,1.75; D4 -1.75,1.75; D12 2.25,1.75; D13 2.75,1.75; D14 3.25,1.75; E1 -3.25,1.25; E2 -2.75,1.25; E3 -2.25,1.25; E5 -1.25,1.25; E6 -0.75,1.25; E7 -0.25,1.25; E8 0.25,1.25; E9 0.75,1.25; E10 1.25,1.25; E12 2.25,1.25; E13 2.75,1.25; E14 3.25,1.25; F1 -3.25,0.75; F2 -2.75,0.75; F3 -2.25,0.75; F5 -1.25,0.75; F10 1.25,0.75; F12 2.25,0.75; F13 2.75,0.75; F14 3.25,0.75; G1 -3.25,0.25; G2 -2.75,0.25; G3 -2.25,0.25; G5 -1.25,0.25; G10 1.25,0.25; G12 2.25,0.25; G13 2.75,0.25; G14 3.25,0.25; H1 -3.25,-0.25; H2 -2.75,-0.25; H3 -2.25,-0.25; H5 -1.25,-0.25; H10 1.25,-0.25; H12 2.25,-0.25; H13 2.75,-0.25; H14 3.25,-0.25; J1 -3.25,-0.75; J2 -2.75,-0.75; J3 -2.25,-0.75; J5 -1.25,-0.75; J10 1.25,-0.75; J12 2.25,-0.75; J13 2.75,-0.75; J14 3.25,-0.75; K1 -3.25,-1.25; K2 -2.75,-1.25; K3 -2.25,-1.25; K5 -1.25,-1.25; K6 -0.75,-1.25; K7 -0.25,-1.25; K8 0.25,-1.25; K9 0.75,-1.25; K10 1.25,-1.25; K12 2.25,-1.25; K13 2.75,-1.25; K14 3.25,-1.25; L1 -3.25,-1.75; L2 -2.75,-1.75; L3 -2.25,-1.75; L12 2.25,-1.75; L13 2.75,-1.75; L14 3.25,-1.75; M1 -3.25,-2.25; M2 -2.75,-2.25; M3 -2.25,-2.25; M4 -1.75,-2.25; M5 -1.25,-2.25; M6 -0.75,-2.25; M7 -0.25,-2.25; M8 0.25,-2.25; M9 0.75,-2.25; M10 1.25,-2.25; M11 1.75,-2.25; M12 2.25,-2.25; M13 2.75,-2.25; M14 3.25,-2.25; N1 -3.25,-2.75; N2 -2.75,-2.75; N3 -2.25,-2.75; N4 -1.75,-2.75; N5 -1.25,-2.75; N6 -0.75,-2.75; N7 -0.25,-2.75; N8 0.25,-2.75; N9 0.75,-2.75; N10 1.25,-2.75; N11 1.75,-2.75; N12 2.25,-2.75; N13 2.75,-2.75; N14 3.25,-2.75; P1 -3.25,-3.25; P2 -2.75,-3.25; P3 -2.25,-3.25; P4 -1.75,-3.25; P5 -1.25,-3.25; P6 -0.75,-3.25; P7 -0.25,-3.25; P8 0.25,-3.25; P9 0.75,-3.25; P10 1.25,-3.25; P11 1.75,-3.25; P12 2.25,-3.25; P13 2.75,-3.25; P14 3.25,-3.25
TDFN1010-4LD-PL-2_MCH = smd 0.051 x 0.051: 1 -0.411,0.325; 2 -0.45,-0.325; 3 0.45,-0.325; 4 0.45,0.325 | smd 0.483 x 0.483 rotated 45: 5 0,0
S3-WROOM32 = smd 1.5 x 0.9: 1 -8.6,9.064; 2 -8.6,7.794; 3 -8.6,6.524; 4 -8.6,5.254; 5 -8.6,3.984; 6 -8.6,2.714; 7 -8.6,1.444; 8 -8.6,0.174; 9 -8.6,-1.096; 10 -8.6,-2.366; 11 -8.6,-3.636; 12 -8.6,-4.906; 13 -8.6,-6.176; 14 -8.6,-7.446; 27 8.6,-7.446; 28 8.6,-6.176; 29 8.6,-4.906; 30 8.6,-3.636; 31 8.6,-2.366; 32 8.6,-1.096; 33 8.6,0.174; 34 8.6,1.444; 35 8.6,2.714; 36 8.6,3.984; 37 8.6,5.254; 38 8.6,6.524; 39 8.6,7.794; 40 8.6,9.064 | smd 0.9 x 1.5: 15 -6.97,-8.836; 16 -5.7,-8.836; 17 -4.43,-8.836; 18 -3.16,-8.836; 19 -1.89,-8.836; 20 -0.62,-8.836; 21 0.65,-8.836; 22 1.92,-8.836; 23 3.19,-8.836; 24 4.46,-8.836; 25 5.73,-8.836; 26 7,-8.836 | smd 0.9 x 0.9: P$2 -2.9,2.76; P$3 -2.9,1.36; P$4 -2.9,-0.04; P$5 -1.5,-0.04; P$6 -1.5,1.36; P$7 -1.5,2.76; P$8 -0.1,2.76; P$9 -0.1,1.36; P$10 -0.1,-0.04
MOUNTINGHOLE_2.5_PLATED = drill 2.5 pad 3.2: P$1 0,0

### Placement (x,y rotation side)
C1  21.13,32.64 270 bottom
C2  24.56,33.58 0 bottom
C3  22.4,32.65 270 bottom
C4  22.57,28.33 180 bottom
C5  5.33,33.15 180 bottom
C8  5.33,31.88 0 bottom
C9  5.33,29.08 180 bottom
C14  26.67,5.49 180 bottom
C17  5.33,27.81 180 bottom
D1  25.12,28.07 90 bottom
IC2  24.57,31.61 90 bottom
J1  11.96,3.45 0 bottom
J2  32.77,3.56 180 bottom
J3  32.77,36.32 0 bottom
JA  25,3 180 top
JB  25,37 180 top
L1  22.99,36.46 0 bottom
R1  25.82,29.57 90 bottom
R2  22.57,29.59 0 bottom
R3  22.57,30.86 180 bottom
R4  24.56,29.57 270 bottom
R18  24.78,5.47 0 bottom
SW1  20.62,3.01 0 bottom
SW2  26.47,3 180 bottom
TP_1V8  7.75,34.42 0 top
TP_3V3  9.53,3.3 0 top
TP_5V  8.13,16.26 0 top
TP_DATA0  17.78,24.26 0 top
TP_EMMC_CLK  15.24,24.26 0 top
TP_EMMC_CMD  13.97,24.26 0 top
TP_GND  0.89,5.84 0 top
U1  13.34,32.77 90 bottom
U2  5.33,30.48 0 bottom
U5  16.69,16.95 270 bottom
U$2  3.51,36.53 0 top
U$120  3.51,3.51 0 top

### Tracks (layer width: path | path; a pad name or v marks a point on that pad's centre or on a via)
1.8V  (via drill 0.3)
  Top 0.152: v8,32.64 8,33.53 | 8,33.53 9.4,34.92 13.34,34.92 15.24,33.02 v17.78,33.02 | 8,33.53 8,34.16 TP_1V8.P$1
  Bottom 0.089: U1.P5 U1.N4 | U1.N4 U1.M4 | U1.N4 U1.P3 | U1.C6 16.59,33.02 v17.78,33.02
  Bottom 0.152: U2.1 5.75,31.8 C8.1 7.37,31.88 | U1.P5 9.94,31.66 9.72,31.88 7.37,31.88 | 7.37,31.88 8,32.51 v8,32.64
3.3V  (via drill 0.3)
  Top 0.152: JA.95 15.94,1.59 15.94,1.22 15.81,1.08 14.45,1.08 14.01,1.52 v13.59,1.52 | TP_3V3.P$1 9.53,4.17 v9.58,4.22
  Top 0.203: JA.86 18,3.77 v17.7,3.47 | v19.56,3.43 19.22,3.77 18.58,3.77 18.43,3.92 18.43,4.32 JA.84
  Bottom 0.089: U1.F5 U1.E6 14.09,32.02 v13.34,32.77 12.59,33.52 U1.J10 U1.K9
  Bottom 0.152: C9.1 C17.1 v4.06,27.81 | U2.4 4.12,30.8 v4.06,30.86 | U5.2 v8.89,24.13 | J1.6 10.46,5.1 v9.58,4.22 | J2.1 35.11,5.65 v35.18,5.59 | v25.26,8.36 24.81,7.91 24.81,7.51 24.27,6.97 R18.2 | J3.3 33.27,36.84 v32.77,37.34 | R2.2 v21.21,29.59 | C4.1 v21.21,28.32
  other vias: 21.59,34.26 22.5,34.26 20.62,34.26
  pour Route2: -1.91,40.39 -1.91,-1.52 40.39,-1.52 40.39,40.51 -1.91,40.51
  pour Bottom: 22.99,32.74 22.99,38.35 19.68,38.35 19.68,32.74
  cutout Route2: -0.25,26.16 -0.25,7.75 6.22,7.75 6.22,26.16
5.0V  (via drill 0.3, 0.51)
  Top 0.152: JA.79 JA.77 19.6,0.74 v19.68,0.65 19.2,1.14 JA.79 | JA.79 JA.81 | JA.81 JA.83 | JA.83 JA.85 | JA.85 JA.87 17.67,1.57 v17.67,0.65 17.72,0.7 18,0.98 JA.85 | JA.83 18.4,0.92 18.61,0.71 | 18.61,0.71 v18.67,0.65 | TP_5V.P$1 v7.24,17.14 | JA.81 18.8,0.89 18.61,0.71
  Top 0.305: 17.76,0.65 17.72,0.7
  Top 0.508: v19.68,0.65 v18.67,0.65 17.76,0.65 | v17.67,0.65 10.27,0.65 6.73,4.19 6.73,16.64 v7.24,17.14 | v14.48,23.37 19.68,23.37 v23.43,27.11 25.78,29.46 v25.78,32.26
  Route2 0.508: v7.24,17.14 13.46,23.37 v14.48,23.37
  Bottom 0.152: R4.2 25.15,29.06 | 25.15,29.06 R1.1 | v23.43,27.11 24.7,27.11 25.15,27.56 25.15,29.06
  pour Bottom: 24.89,34.16 24.89,31.5 26.42,31.5 26.42,34.16
BOOT0
  Bottom 0.089: U5.27 24.13,8.01 21.26,5.13 21.26,2.82 22.14,1.94 SW1.B' SW1.B
DATA0  (via drill 0.3)
  Top 0.152: U5.9 TP_DATA0.P$1
  Bottom 0.089: U1.A3 17.63,29.47 arc-45 17.71,29.29 17.71,27.75 arc-90 17.55,27.6 17.44,27.6 arc90 17.28,27.44 17.28,27.41 arc90 17.44,27.26 17.98,27.26 arc-90 18.14,27.1 18.14,27.07 arc-90 17.98,26.91 17.44,26.91 arc90 17.28,26.76 17.28,26.73 arc90 17.44,26.57 17.55,26.57 arc-90 17.71,26.42 17.71,25.63 U5.9
  other vias: 17.78,25.55
DATA1
  Bottom 0.089: U1.A4 18.98,28.62 arc-45 19.05,28.44 19.05,28.09 arc-90 18.9,27.94 18.82,27.94 arc90 18.67,27.78 18.67,27.72 arc90 18.82,27.57 18.9,27.57 arc-90 19.05,27.41 19.05,27.35 arc-90 18.9,27.2 18.82,27.2 arc90 18.67,27.04 18.67,26.98 arc90 18.82,26.83 18.9,26.83 arc-90 19.05,26.67 U5.10
DATA2
  Bottom 0.089: U1.A5 20.25,27.85 arc-45 20.32,27.67 U5.11
DATA3
  Bottom 0.089: U5.8 16.51,26.92 arc90 16.36,27.08 15.11,27.08 arc-90 14.95,27.23 14.95,27.24 arc-90 15.11,27.39 16.36,27.39 arc90 16.51,27.55 16.51,28.72 arc45 16.44,28.9 16.09,29.25 U1.B2
EMMC_CLK  (via drill 0.3)
  Top 0.152: v15.29,25.5 15.29,24.31 TP_EMMC_CLK.P$1
  Bottom 0.089: U1.M6 12.09,31.01 12.09,29.44 15.24,26.29 U5.7
  Bottom 0.152: U5.7 v15.29,25.5
EMMC_CMD  (via drill 0.3)
  Top 0.152: TP_EMMC_CMD.P$1 v13.97,26.23 v13.97,26.24
  Bottom 0.089: U1.M5 11.58,31.02 11.58,29.18 12.19,28.57 arc-90 12.19,28.36 12.14,28.3 arc90 12.14,28.08 12.18,28.04 arc90 12.4,28.04 12.45,28.1 arc-90 12.67,28.1 12.71,28.06 arc-90 12.71,27.84 12.66,27.78 arc90 12.66,27.56 12.7,27.52 arc90 12.91,27.52 12.97,27.58 arc-90 13.19,27.58 13.97,26.79 v13.97,26.24
  Bottom 0.152: U5.6 v13.97,26.24
EN
  Bottom 0.152: IC2.P$1 25.82,30.22 R1.2
FB
  Bottom 0.152: C4.2 23.05,29.57 R2.1 R3.2 23.18,30.96 IC2.P$3
GND  (via drill 0.3)
  Top 0.089: v26.4,0.88 JA.43 | v24.38,0.65 24.38,1.63 JA.53
  Bottom 0.089: U1.P4 9.3,31.02 v9.27,30.99 9.27,30.35 9.61,30.02 U1.N2 | C8.2 5.32,31.41 5.32,30.5 | U1.N5 U1.P6 9.4,32.7 v9.4,33.53 11.57,33.53 U1.K8 12.59,32.52 | U1.C4 U1.A6 17.26,32.02 v17.27,32 | U1.E7 15.6,33.53 17.14,33.53 v17.65,34.04 | U1.J5 12.59,32.52 | U1.G5 12.59,32.52 | U1.H10 v13.09,36.7 v13.08,36.7 | SW1.A' 22.86,3.82 22.86,2.8 23.74,1.92 SW2.A' 24.49,0.76 v24.38,0.65 | SW2.A 27.44,1.92 v26.4,0.88
  Bottom 0.152: 5.32,30.5 U2.5 | 4.85,31.68 C8.2 C5.1 v4.06,33.15 | U2.5 5.33,29.57 C9.2 C17.2 5.82,26.95 v5.84,26.92 | U2.2 5.66,30.16 U2.5 | C14.2 v26.98,5.49
  Bottom 0.203: D1.C 26.29,27.65 v26.29,26.92
  Bottom 0.305: U5.40 v7.62,9.78 | J1.7 J1.8 8.43,5.84 v7.62,5.84 | SW1.A 18.65,4.3 v19.68,5.33 | J2.4 30.67,5.65 v30.35,5.97 | U5.1 v7.62,24.13 | J3.4 35.12,34.22 v35.18,34.16
  other vias: 15.33,18.45 16.73,17.05 16.73,18.45 16.73,19.85 15.33,19.85 13.93,19.85 13.93,18.45 13.93,17.05 15.33,17.05 20.83,30.86 23.37,32.13 0.94,7.21 2.08,7.21 3.23,7.21 4.37,7.21 5.51,7.21 0.81,26.77 1.96,26.77 3.12,26.77 4.34,26.8 2.08,6.07 5.26,5.82 5.77,1.24 10.85,1.75 36.88,3.4 34.09,3.15 32.82,3.02 9.83,12.8 9.83,14.71 11.73,12.8 13.77,12.17 14.78,14.58 16.43,13.18 17.58,14.83 19.99,13.69 19.99,15.98 21.64,15.09 21.39,18.14 19.35,18.14 20.37,20.17 22.02,21.06 18.72,21.18 15.93,21.69 13.51,21.69 11.99,23.72 9.7,21.95 8.31,22.71 7.29,21.69 8.56,20.68 7.42,20.17 12.37,17.37 9.58,17.37 11.1,27.41 9.19,27.66 7.54,28.3 7.8,30.71 2.97,29.18 2.34,31.47 2.08,33.38 7.29,37.31 8.56,38.71 10.21,37.57 12.12,38.58 15.54,37.06 17.32,37.06 18.85,37.06 27.48,36.93 28.75,36.93 36.75,36.68 36.75,35.41 36.5,34.26 18.85,31.34 18.97,34.26 21.51,22.96 23.42,22.2 20.88,5.94 11.61,14.45 8.43,11.53 8.18,14.71
  pour Route15: -2.29,40.89 -2.29,-2.03 41.02,-2.03 41.02,41.02 40.89,41.15 -2.03,41.15
  pour Top: -3.05,41.78 -3.05,-2.67 41.91,-2.67 42.04,-2.54 42.04,41.66 42.29,41.91 -2.79,41.91 -2.92,41.78
  pour Bottom: 19.68,32.54 23.19,32.54 23.19,34.16 24.13,34.16 24.13,31.5 22.48,31.5 22.48,30.23 19.68,30.23
  cutout Top: 0,26.16 6.22,26.16 6.22,7.75 -0.25,7.75 -0.25,26.16
  cutout Route15: -0.25,26.16 -0.25,7.75 6.22,7.75 6.22,26.16
I2S_BCLK  (via drill 0.3)
  Top 0.089: v10.16,9.78 11.05,8.89 11.05,3.52 v11.73,2.84 | JA.49 25.2,2 24.61,2.59 15.32,2.59 14.86,3.05 v13.97,3.05
  Route2 0.089: v11.73,2.84 13.76,2.84 v13.97,3.05
  Bottom 0.152: U5.38 v10.16,9.78
I2S_DIN  (via drill 0.3)
  Top 0.089: JA.27 29.51,1.55 29.51,1.23 29.04,0.76 v28.57,0.76
  Route2 0.089: U5.23 26.3,12.99 26.3,12.35 25.91,11.96 25.91,4.95 27.67,3.19 27.67,2.9 28.57,2 v28.57,0.76
  other vias: 25.52,13.76
I2S_DOUT  (via drill 0.3)
  Top 0.089: JA.25 30,2.4 30.23,2.63 v30.23,3.43
  Route15 0.089: v22.43,10.26 26.47,6.22 27.97,6.22 30.23,3.97 v30.23,3.43
  Bottom 0.152: U5.28 22.86,9.83 v22.43,10.26
I2S_LRCLK  (via drill 0.3)
  Top 0.089: v8.89,9.78 10.04,10.93 24,10.93 30,4.93 JA.26
  Bottom 0.152: U5.39 v8.89,9.78
IO3  (via drill 0.3)
  Route15 0.152: v25.53,25.02 25.53,29.72 24.64,30.61 24.64,32.77 26.8,34.92 29.37,34.92 v30.48,33.82
  Bottom 0.152: U5.15 v25.52,25.02 v25.53,25.02 | J3.1 30.86,33.82 v30.48,33.82
IO4  (via drill 0.3)
  Route15 0.152: v32.38,33.67 30.24,35.81 25.78,35.81 21.97,32 20.83,32 14.38,25.55 U5.4
  Bottom 0.152: J3.2 32.38,34.1 v32.38,33.67
  other vias: 11.43,25.55
N$1
  pour Bottom: 24.38,31.5 24.38,34.34 23.19,34.34 23.19,38.35 26.42,38.35 26.42,34.34 24.71,34.34 24.71,31.5
N$2
  Bottom 0.152: IC2.P$2 24.57,30.09 R4.1 24.23,30.07 23.88,29.72 23.88,28.45 24.26,28.07 D1.A
N$8  (via drill 0.3)
  Route15 0.089: v15.49,28.7 8.51,28.7 6.6,30.61 v6.6,33.15
  Bottom 0.089: U1.C2 15.59,28.79 v15.49,28.7 | v6.6,33.15 C5.2
RESET  (via drill 0.3)
  Top 0.089: v26.86,6.88 20.21,6.88 v20.08,7
  Route2 0.089: v20.08,7 17.27,9.81 17.27,10.29 10.92,16.64 v10.92,18.8
  Route15 0.089: v10.92,18.8 10.92,23.11 v10.29,23.75
  Bottom 0.089: v26.86,6.88 26.86,6.29 26.33,5.76 26.33,5.63 C14.1 | U5.3 10.29,25.43 v10.29,23.75 | J1.5 11.46,4.16 13.22,2.4 14.24,2.4 15.4,3.56 16.64,3.56 v20.08,7
  Bottom 0.152: SW2.B' 25.29,4.86 R18.1 25.3,5.49 C14.1 26.29,5.38 26.29,4.83 27.04,4.07 SW2.B
SAM_BOOT  (via drill 0.3)
  Top 0.089: JA.29 29.2,3.15 v29.28,3.24
  Route2 0.089: U5.22 26.61,13.95 26.61,12.15 26.16,11.71 26.16,5.08 27.41,3.83 28.59,3.83 29.18,3.24 v29.28,3.24
  other vias: 25.52,15.03
SAM_INTERUPT  (via drill 0.3)
  Top 0.089: JA.46 25.99,4.36 25.99,4.94 25.37,5.55 v22.61,5.55
  Route2 0.089: v23.5,19.68 22.73,18.92 22.73,13.04 23.33,12.44 23.33,6.28 v22.61,5.55
  Bottom 0.089: U5.17 25.32,21.38 23.55,19.62 v23.5,19.68
SCL0  (via drill 0.3)
  Top 0.089: v17.16,6.35 17.8,5.71 18.29,5.71 19.2,4.8 JA.80
  Route15 0.089: v18.95,11.71 18.95,10.6 17.13,8.78 17.13,6.38 v17.16,6.35 | v24.87,11.22 25.35,10.75 25.35,9.33 30.1,4.57 32.51,4.57 33.27,5.33 J2.2
  Bottom 0.089: v18.95,11.71 18.95,11.48 19.2,11.22 v24.87,11.22 U5.25
  other vias: 33.27,5.65
SCL1  (via drill 0.3)
  Top 0.089: JA.56 24,3.5 v23.75,3.25
  Route2 0.089: v24.26,14.99 24.26,14.83 24.22,14.8 24.22,3.72 v23.75,3.25
  Bottom 0.089: U5.20 24.3,17.57 24.13,17.4 24.13,15.11 v24.26,14.99
SDA0  (via drill 0.3)
  Top 0.089: JA.82 18.79,4.36 18.79,4.82 18.21,5.39 v17.14,5.39
  Route15 0.089: v17.68,11.91 17.68,9.8 16.51,8.64 16.51,6.02 v17.14,5.39 | U5.24 25.52,9.4 30.1,4.83 31.75,4.83 32.27,5.34 J2.3
  Bottom 0.089: U5.24 18.31,12.49 17.73,11.91 v17.68,11.91
  other vias: 25.52,12.49 32.27,5.65
SDA1  (via drill 0.3)
  Top 0.089: v21.92,3.25 22.83,3.25 23.6,4.02 JA.58
  Route2 0.089: v23.5,13.46 23.62,13.34 23.62,4.95 v21.92,3.25
  Bottom 0.089: U5.19 24.43,18.84 23.5,17.91 v23.5,13.46
SOC_SPI_CLK  (via drill 0.3)
  Top 0.089: J1.2 14.46,7.61 15.37,8.51 20.57,8.51 21.59,9.53 v21.59,9.78 | JA.38 27.6,4.99 v27.94,5.33
  Route15 0.089: v21.59,9.78 26.04,5.33 26.21,5.33 26.71,4.83 27.25,4.83 27.75,5.33 v27.94,5.33
  Bottom 0.152: U5.29 v21.59,9.78
  other vias: 14.46,5.88
SOC_SPI_MISO
  Bottom 0.089: J1.1 15.46,6.51 13.97,8 U5.35
SOC_SPI_MOSI  (via drill 0.3)
  Top 0.089: JA.44 26.42,4.33 v26.42,3.43
  Route15 0.089: v20.32,9.78 20.32,9.02 22.23,7.11 22.73,7.11 v26.42,3.43
  Bottom 0.152: U5.30 v20.32,9.78
SOM_STATUS  (via drill 0.3)
  Top 0.089: v31.14,2.86 31.14,2.31 30.8,1.97 JA.21
  Bottom 0.089: U5.21 25.86,16.3 26.67,15.49 26.67,8.13 31.13,3.67 v31.13,2.87 v31.14,2.86
TDI_RX  (via drill 0.3)
  Top 0.089: v13.46,4.32 13.46,8 v15.24,9.78
  Bottom 0.089: J1.3 v13.46,4.32 | U5.34 15.24,9.14 v15.24,9.78
TDO_TX  (via drill 0.3)
  Top 0.089: v12.45,4.32 12.45,8.26 14.62,10.43 15.86,10.43 v16.51,9.78
  Bottom 0.089: J1.4 12.46,4.33 v12.45,4.32 | U5.33 v16.51,9.78
UART_RXD0  (via drill 0.3)
  Top 0.089: v12.7,9.78 12.7,8.76 11.79,7.86 11.79,4.05 13.45,2.4 24.42,2.4 24.8,2.02 JA.51
  Bottom 0.152: U5.36 v12.7,9.78
UART_RXD3_SAM  (via drill 0.3)
  Top 0.089: JA.34 28.4,3.25 v28.32,3.17
  Route15 0.089: v28.32,3.17 27.91,2.77 26.06,2.77 25.76,3.07 25.76,3.71 22.61,6.86 22.07,6.86 v19.05,9.78
  Bottom 0.152: U5.31 v19.05,9.78
UART_TXD0  (via drill 0.3)
  Top 0.089: v11.43,9.78 11.43,4.06 13.28,2.21 23.82,2.21 24,2.04 JA.55
  Bottom 0.152: U5.37 v11.43,9.78
UART_TXD3_SAM  (via drill 0.3)
  Top 0.089: JA.54 24.4,3.84 v25.07,3.17
  Route15 0.089: v25.07,3.17 25.07,4.01 22.48,6.6 21.92,6.6 20.78,7.75 v17.78,7.75
  Bottom 0.152: U5.32 v17.78,7.75
USB_N  (via drill 0.3)
  Top 0.089: v23.02,24.13 23.41,24.52 23.41,25.44 26.67,28.7 26.67,33.48 27.66,34.47 33.83,34.47 34.42,35.05 34.42,35.62 JB.3
  Bottom 0.089: U5.13 22.86,24.63 23.02,24.47 v23.02,24.13
USB_P  (via drill 0.3)
  Top 0.089: v23.98,24.13 23.59,24.52 23.59,25.37 26.85,28.63 26.85,33.4 27.26,33.82 v28.07,33.82 | JB.5 34,36.41 v34.04,36.45
  Route2 0.089: v28.07,33.82 30.7,36.45 v34.04,36.45
  Bottom 0.089: U5.14 24.13,24.63 23.98,24.47 v23.98,24.13

### Text on the board
bNames: MicroSOM V0.1 / © PamirAI Inc. 2024